# EAGLE design breakout0 (EAGLE 5.11)
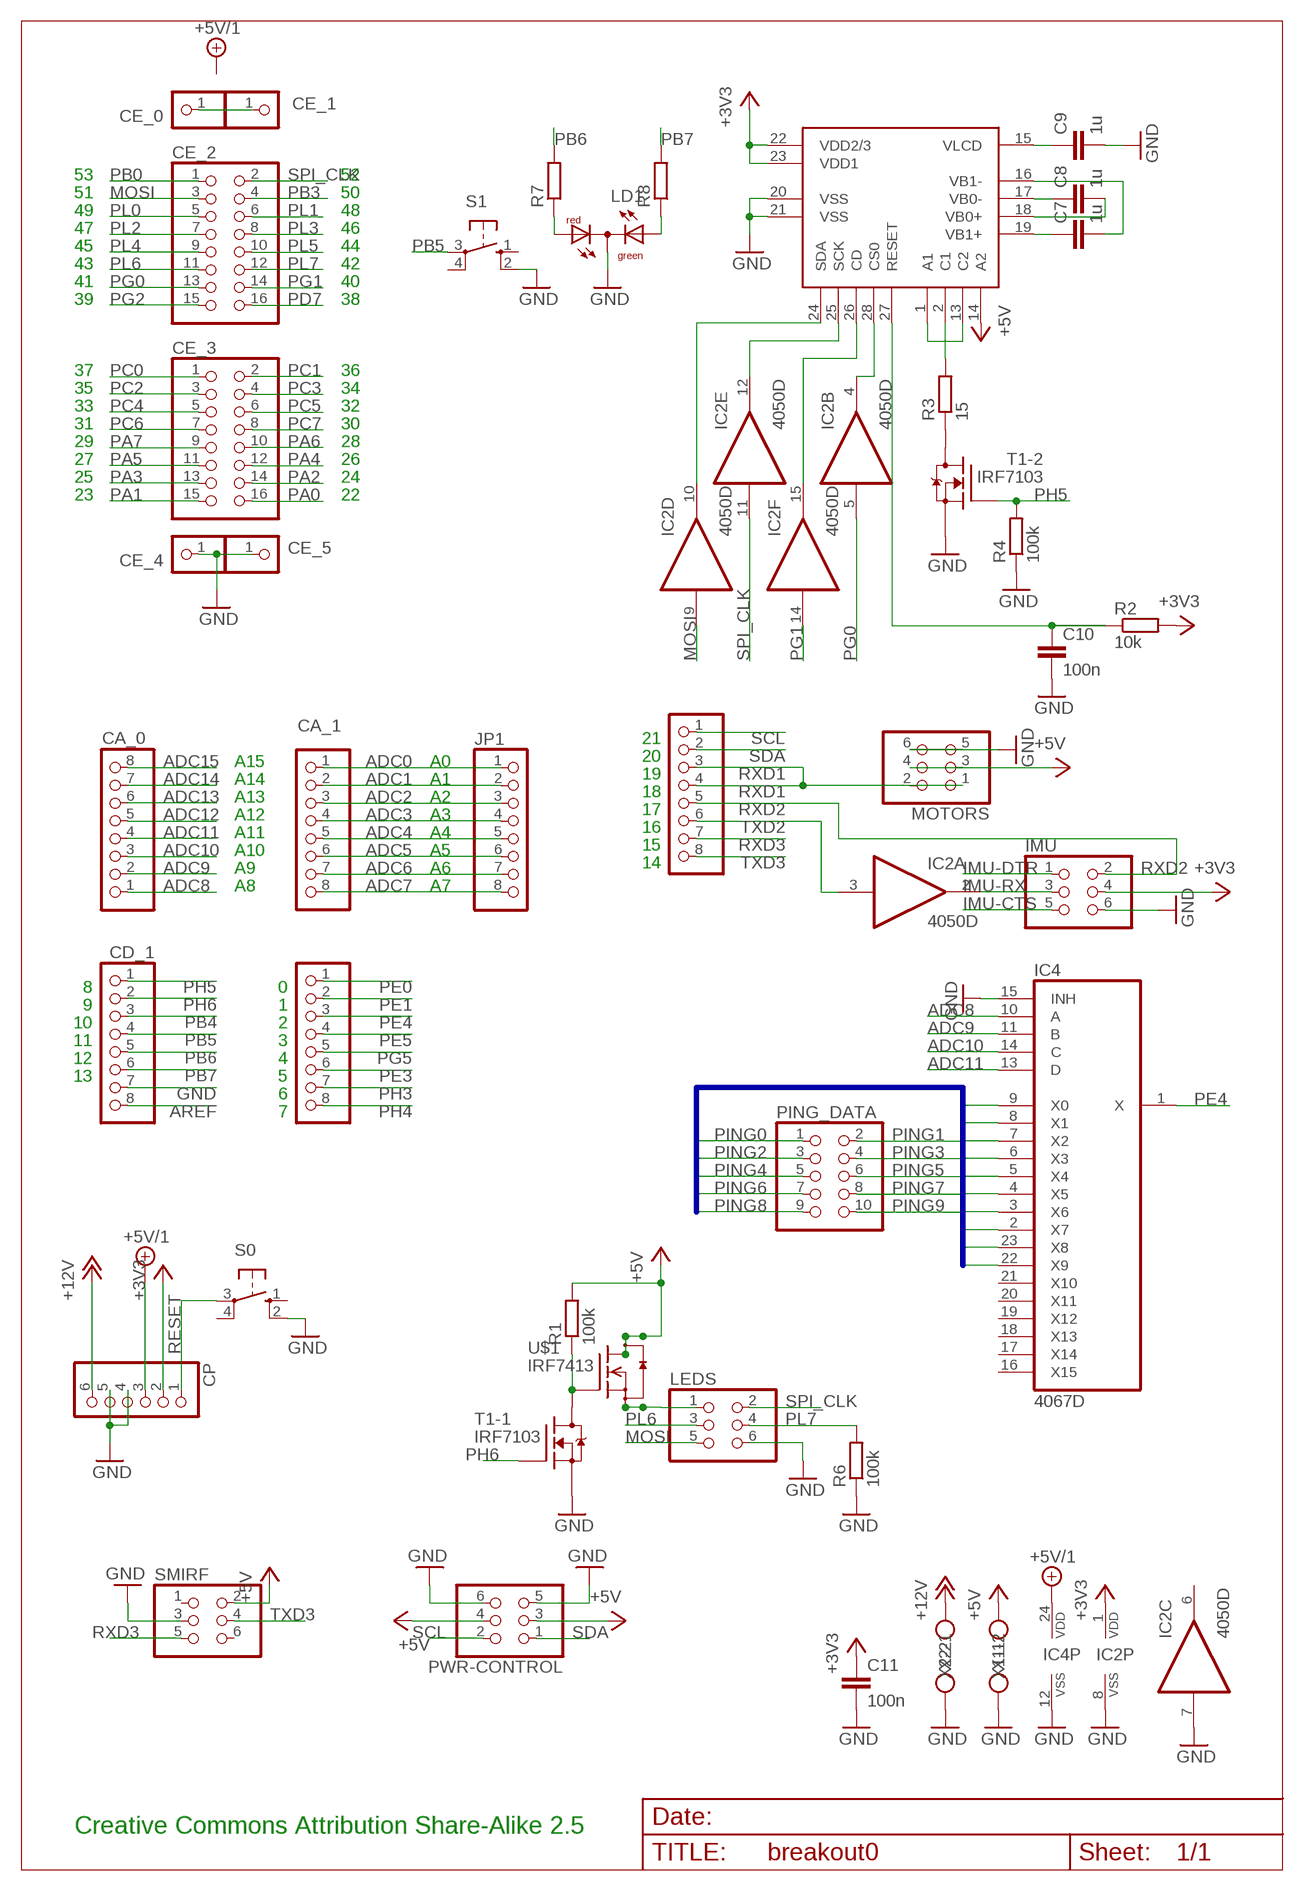
[diagram p0: schematic, sheet 1]

## Parts
C7  1u  C-EUC0805K  [C0805K]
C8  1u  C-EUC0805K  [C0805K]
C9  1u  C-EUC0805K  [C0805K]
C10  100n  C-EUC0805K  [C0805K]
C11  100n  C-EUC0805K  [C0805K]
CA_0  PINHD-1X8  [1X08]
CA_1  PINHD-1X8  [1X08]
CC  PINHD-1X8  [1X08]
CD_0  PINHD-1X8  [1X08]
CD_1  PINHD-1X8  [1X08]
CE_0  PINHD-1X1  [1X01]
CE_1  PINHD-1X1  [1X01]
CE_2  PINHD-2X8  [2X08]
CE_3  PINHD-2X8  [2X08]
CE_4  PINHD-1X1  [1X01]
CE_5  PINHD-1X1  [1X01]
CP  PINHD-1X6  [1X06]
IC2  4050D  [SO16]
IC3  DOGS 102  DOGS102  [DOGS102]
IC4  4067D  [SO24W]
IMU  PINHD-2X3  [2X03]
JP1  PINHD-1X8  [1X08]
LD1  DUOLED-RG-C  [DUOLED-C-5MM]
LEDS  PINHD-2X3  [2X03]
MOTORS  PINHD-2X3  [2X03]
PING_DATA  PINHD-2X5  [2X05]
PWR-CONTROL  PINHD-2X3  [2X03]
R1  100k  R-EU_M0805  [M0805]
R2  10k  R-EU_M0805  [M0805]
R3  15  R-EU_M0805  [M0805]
R4  100k  R-EU_M0805  [M0805]
R6  100k  R-EU_M0805  [M0805]
R7  R-EU_M0805  [M0805]
R8  R-EU_M0805  [M0805]
S0  10-XX  [B3F-10XX]
S1  10-XX  [B3F-10XX]
SMIRF  PINHD-2X3  [2X03]
T1  IRF7103  [SO-8]
U$1  IRF7413  [SO08-IRF]
X1  MKDSN1,5/2-5,08  [MKDSN1,5/2-5,08]
X2  MKDSN1,5/2-5,08  [MKDSN1,5/2-5,08]

## Nets
+3V3: C11.1 CP.2 IC2.1(P:VDD) IC3.22(VDD2/3) IC3.23(VDD1) IMU.4 R2.2
+5V [power]: IC3.14(A2) MOTORS.3 MOTORS.4 PWR-CONTROL.3 PWR-CONTROL.4 R1.2 SMIRF.2 U$1.5(D1) U$1.6(D2) U$1.7(D3) U$1.8(D4) X1.1
+5V/1 [power]: CP.3 IC4.24(VDD)
+12V: CP.6 X2.2
ADC0: CA_1.1 JP1.1
ADC1: CA_1.2 JP1.2
ADC2: CA_1.3 JP1.3
ADC3: CA_1.4 JP1.4
ADC4: CA_1.5 JP1.5
ADC5: CA_1.6 JP1.6
ADC6: CA_1.7 JP1.7
ADC7: CA_1.8 JP1.8
ADC8: CA_0.1 IC4.10(A)
ADC9: CA_0.2 IC4.11(B)
ADC10: CA_0.3 IC4.14(C)
ADC11: CA_0.4 IC4.13(D)
ADC12: CA_0.5
ADC13: CA_0.6
ADC14: CA_0.7
ADC15: CA_0.8
AREF: CD_1.8
GND [gnd]: C9.2 C10.2 C11.2 CD_1.7 CE_4.1 CE_5.1 CP.4 CP.5 IC2.7(C:I) IC2.8(P:VSS) IC3.20(VSS) IC3.21(VSS) IC4.12(VSS) IC4.15(INH) IMU.6 LD1.C LEDS.6 MOTORS.5 MOTORS.6 PWR-CONTROL.5 PWR-CONTROL.6 R4.1 R6.1 S0.2(S1) S1.2(S1) SMIRF.3 T1.1(-1:S) T1.3(-2:S) X1.2 X2.1
IMU-CTS: IMU.5
IMU-DTR: IMU.1
IMU-RX: IC2.2(A:O) IMU.3
LCD_CD: IC2.15(F:O) IC3.26(CD)
LCD_CS0: IC2.4(B:O) IC3.28(CS0)
LCD_RESET: C10.1 IC3.27(RESET) R2.1
LCD_SCK: IC2.12(E:O) IC3.25(SCK)
LCD_SDA: IC2.10(D:O) IC3.24(SDA)
MOSI: CE_2.3 IC2.9(D:I) LEDS.5
N$1: R3.1 T1.5(-2:D1)
N$2 [power]: LEDS.1 U$1.1(S1) U$1.2(S2) U$1.3(S3)
N$3: R1.1 T1.7(-1:D1) U$1.4(G)
N$4: LD1.AR R7.1
N$5: LD1.AX(AG) R8.1
N$7 [power]: CE_0.1 CE_1.1
N$13: IC3.1(A1) IC3.13(C2)
N$14: IC3.2(C1) R3.2
N$17: C8.1 IC3.17(VB0-)
N$18: C8.2 IC3.18(VB0+)
N$19: C7.1 IC3.19(VB1+)
N$20: C7.2 IC3.16(VB1-)
N$21: C9.1 IC3.15(VLCD)
PA0: CE_3.16
PA1: CE_3.15
PA2: CE_3.14
PA3: CE_3.13
PA4: CE_3.12
PA5: CE_3.11
PA6: CE_3.10
PA7: CE_3.9
PB0: CE_2.1
PB3: CE_2.4
PB4: CD_1.3
PB5: CD_1.4 S1.3(P)
PB6: CD_1.5 R7.2
PB7: CD_1.6 R8.2
PC0: CE_3.1
PC1: CE_3.2
PC2: CE_3.3
PC3: CE_3.4
PC4: CE_3.5
PC5: CE_3.6
PC6: CE_3.7
PC7: CE_3.8
PD7: CE_2.16
PE0: CD_0.1
PE1: CD_0.2
PE3: CD_0.6
PE4: CD_0.3 IC4.1(X)
PE5: CD_0.4
PG0: CE_2.13 IC2.5(B:I)
PG1: CE_2.14 IC2.14(F:I)
PG2: CE_2.15
PG5: CD_0.5
PH3: CD_0.7
PH4: CD_0.8
PH5: CD_1.1 R4.2 T1.4(-2:G)
PH6: CD_1.2 T1.2(-1:G)
PING0: IC4.9(X0) PING_DATA.1
PING1: IC4.8(X1) PING_DATA.2
PING2: IC4.7(X2) PING_DATA.3
PING3: IC4.6(X3) PING_DATA.4
PING4: IC4.5(X4) PING_DATA.5
PING5: IC4.4(X5) PING_DATA.6
PING6: IC4.3(X6) PING_DATA.7
PING7: IC4.2(X7) PING_DATA.8
PING8: IC4.23(X8) PING_DATA.9
PING9: IC4.22(X9) PING_DATA.10
PL0: CE_2.5
PL1: CE_2.6
PL2: CE_2.7
PL3: CE_2.8
PL4: CE_2.9
PL5: CE_2.10
PL6: CE_2.11 LEDS.3
PL7: CE_2.12 LEDS.4 R6.2
RESET: CP.1 S0.3(P)
RXD1: CC.3 CC.4 MOTORS.1 MOTORS.2
RXD2: CC.5 IMU.2
RXD3: CC.7 SMIRF.5
SCL: CC.1 PWR-CONTROL.2
SDA: CC.2 PWR-CONTROL.1
SPI_CLK: CE_2.2 IC2.11(E:I) LEDS.2
TXD2: CC.6 IC2.3(A:I)
TXD3: CC.8 SMIRF.4
Unconnected: IC2.6(C:O) IC4.16(X15) IC4.17(X14) IC4.18(X13) IC4.19(X12) IC4.20(X11) IC4.21(X10) S0.1(S) S0.4(P1) S1.1(S) S1.4(P1) SMIRF.1 SMIRF.6 T1.6(-2:D) T1.8(-1:D)

## Buses
PING[0..9]

## Notes on the sheet
- 53 | 52
- 51 | 50
- 49 | 48
- 47 | 46
- 45 | 44
- 43 | 42
- 41 | 40
- 39 | 38
- 37 | 36
- 35 | 34
- 33 | 32
- 31 | 30
- 29 | 28
- 27 | 26
- 25 | 24
- 23 | 22
- 21
- 20
- A15 | A0 | 19
- A14 | A1 | 18
- A13 | A2 | 17
- A12 | A3 | 16
- A11 | A4 | 15
- A10 | A5 | 14
- A9 | A6
- A8 | A7
- 8 | 0
- 9 | 1
- 10 | 2
- 11 | 3
- 12 | 4
- 13 | 5
- 6
- 7
- Creative Commons Attribution Share-Alike 2.5

## Library data of the parts
C7-C11 = rcl:C-EU: CAPACITOR, European symbol
CA_0 CA_1 CC CD_0 CD_1 JP1 = pinhead:PINHD-1X8: PIN HEADER
CE_0 CE_1 CE_4 CE_5 = pinhead:PINHD-1X1: PIN HEADER
CE_2 CE_3 = pinhead:PINHD-2X8: PIN HEADER
CP = pinhead:PINHD-1X6: PIN HEADER
IC2 = 40xx:4050: Hex non-inverting BUFFER
IC3 = DOGS102:DOGS102: DOGS102-6 GRAFIK 102x64 39x41 mm LED-BELEUCHTUNG WEISS, EA LED39X41-W LED-BELEUCHTUNG AMBER, EA LED39X41-A LED-BELEUCHTUNG GR/ROT , EA LED39X41-GR
IC4 = 40xx:4067: 16-channel ANALOG MULTIPLEXER
IMU LEDS MOTORS PWR-CONTROL SMIRF = pinhead:PINHD-2X3: PIN HEADER
LD1 = led:DUOLED-RG-C: DUO LED 2 colors (red/green), 5 mm, round, common Cathode www.ligitek.com or other producers.
PING_DATA = pinhead:PINHD-2X5: PIN HEADER
R1-R3 R7 R8 = rcl:R-EU_: RESISTOR, European symbol
R4 R6 = resistor:R-EU_: RESISTOR, European symbol
S0 S1 = switch-omron:10-XX: OMRON SWITCH
T1 = transistor-fet:IRF7103: Dual N-Channel MOSFET
U$1 = transistor-fet:IRF7413: HEXFET Power MOSFET
X1 X2 = con-phoenix-508:MKDSN1,5/2-5,08: MKDSN 1,5/ 2-5,08 Printklemme Nennstrom: 13,5 A Nennspannung: 250 V Rastermaß: 5,08 mm Polzahl: 2 Anschlussart: Schraubanschluss Montage: Löten Anschlussrichtung Leiter/Platine: 0 ° Artikelnummer: 1729128 Source: http://eshop.phoenixcontact.com .. 1729128.pdf

## Net classes
0 default: width 0.203 mm, drill 0.406 mm, clearance 0.203 mm
1 power: width 0.61 mm, drill 0.711 mm, clearance 0.203 mm
2 gnd: width 0.305 mm, drill 0.711 mm, clearance 0.203 mm
3 usbvcc: width 0.508 mm, drill 0.711 mm, clearance 0.203 mm

## Board
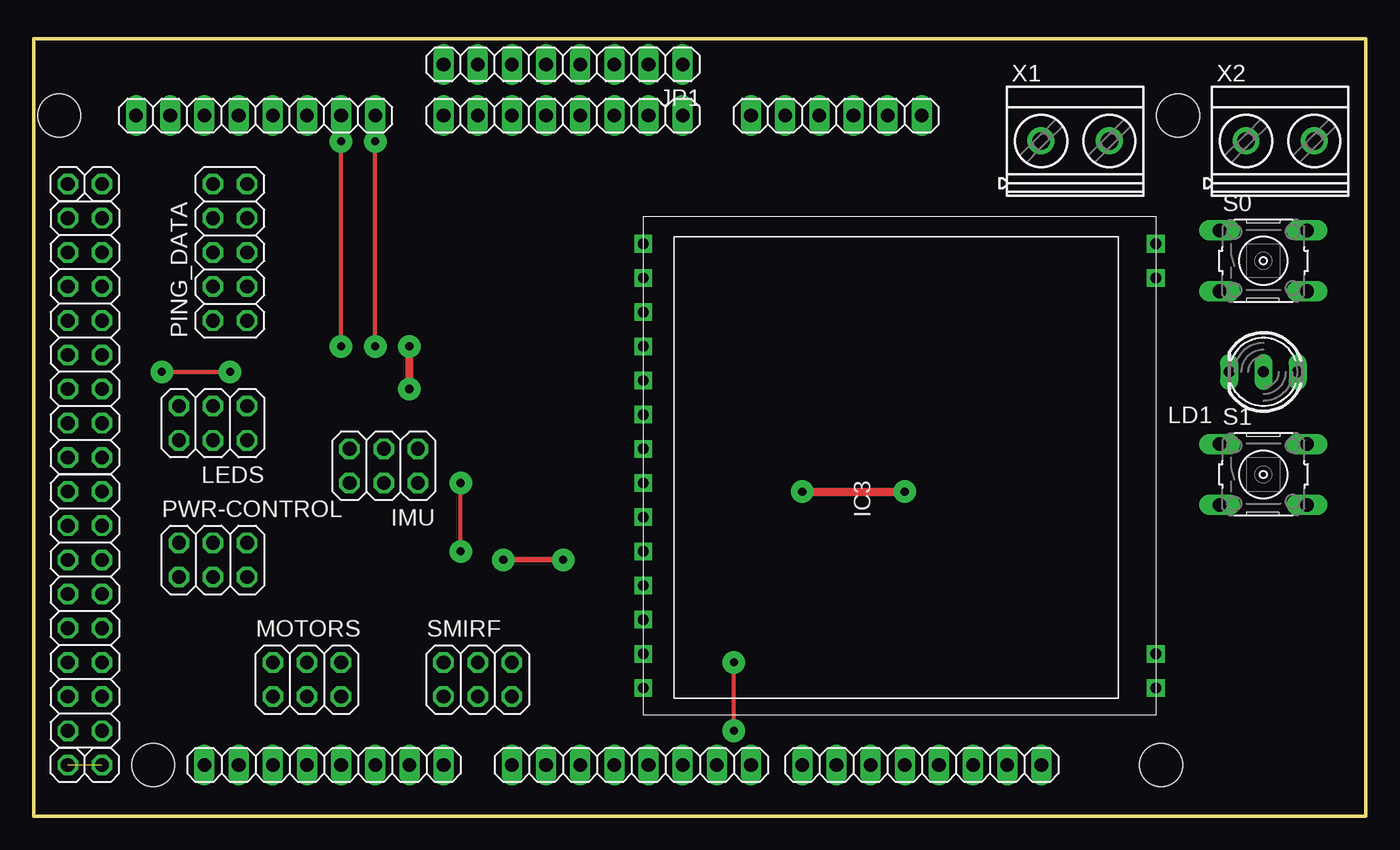
[diagram p1: board, top side]
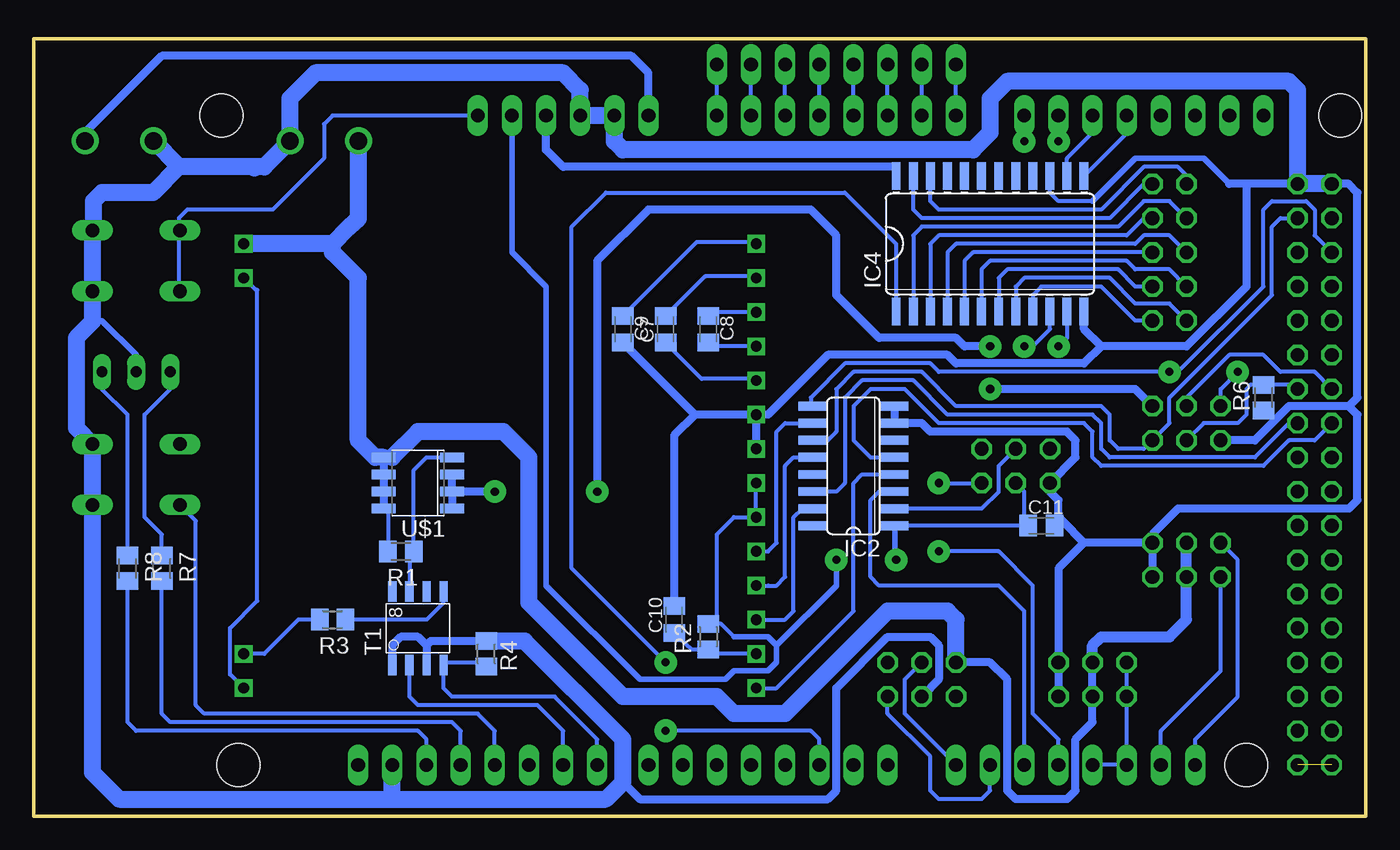
[diagram p2: board, bottom side, seen from below]

Size 99.06 x 57.78 mm. Coordinates in mm from the lower left corner, seen from the top.
Outline: 99.06,0 0,0 0,57.78 99.06,57.78 99.06,0
Copper layers (1*16): Top 0.035mm / dielectric 1.5mm / Bottom 0.035mm
Design rules "default *": minimum track width 8mil, minimum drill 16mil, track to track 8mil, track to pad 8mil, pad to pad 8mil, via to via 10mil, smd to smd 8mil, copper to edge 40mil, drill to drill 12mil, minimum pad ring 10mil, minimum via ring 10mil, stop-mask expansion 4mil, vias tented up to drill 0mil, thermal gap 10mil
Holes 3.2 mm at 85.09,52.07 83.82,3.81 8.89,3.81 1.91,52.07
bKeepout: area 85.7,1.9 to 99.1,21.6

### Footprints (pad centres in the part's own frame; a part is rotated, then mirrored left to right if it is on the bottom)
C0805K = smd 1.3 x 1.6: 1 -1,0; 2 1,0
1X08 = drill 1.016 long: 1 -8.89,0; 2 -6.35,0; 3 -3.81,0; 4 -1.27,0; 5 1.27,0; 6 3.81,0; 7 6.35,0; 8 8.89,0
1X01 = drill 1.016 octagon: 1 0,0
2X08 = drill 1.016 octagon: 1 -8.89,-1.27; 2 -8.89,1.27; 3 -6.35,-1.27; 4 -6.35,1.27; 5 -3.81,-1.27; 6 -3.81,1.27; 7 -1.27,-1.27; 8 -1.27,1.27; 9 1.27,-1.27; 10 1.27,1.27; 11 3.81,-1.27; 12 3.81,1.27; 13 6.35,-1.27; 14 6.35,1.27; 15 8.89,-1.27; 16 8.89,1.27
1X06 = drill 1.016 long: 1 -6.35,0; 2 -3.81,0; 3 -1.27,0; 4 1.27,0; 5 3.81,0; 6 6.35,0
SO16 = smd 0.66 x 2.032: 1 -4.445,-3.073; 2 -3.175,-3.073; 3 -1.905,-3.073; 4 -0.635,-3.073; 5 0.635,-3.073; 6 1.905,-3.073; 7 3.175,-3.073; 8 4.445,-3.073; 9 4.445,3.073; 10 3.175,3.073; 11 1.905,3.073; 12 0.635,3.073; 13 -0.635,3.073; 14 -1.905,3.073; 15 -3.175,3.073; 16 -4.445,3.073
DOGS102 = drill 0.8 square: 1 -17.018,-19.304; 2 -14.478,-19.304; 13 13.462,-19.304; 14 16.002,-19.304; 15 16.002,18.796; 16 13.462,18.796; 17 10.922,18.796; 18 8.382,18.796; 19 5.842,18.796; 20 3.302,18.796; 21 0.762,18.796; 22 -1.778,18.796; 23 -4.318,18.796; 24 -6.858,18.796; 25 -9.398,18.796; 26 -11.938,18.796; 27 -14.478,18.796; 28 -17.018,18.796
SO24W = smd 0.66 x 2.032: 1 -6.985,-5.029; 2 -5.715,-5.029; 3 -4.445,-5.029; 4 -3.175,-5.029; 5 -1.905,-5.029; 6 -0.635,-5.029; 7 0.635,-5.029; 8 1.905,-5.029; 9 3.175,-5.029; 10 4.445,-5.029; 11 5.715,-5.029; 12 6.985,-5.029; 13 6.985,5.029; 14 5.715,5.029; 15 4.445,5.029; 16 3.175,5.029; 17 1.905,5.029; 18 0.635,5.029; 19 -0.635,5.029; 20 -1.905,5.029; 21 -3.175,5.029; 22 -4.445,5.029; 23 -5.715,5.029; 24 -6.985,5.029
2X03 = drill 1.016 octagon: 1 -2.54,-1.27; 2 -2.54,1.27; 3 0,-1.27; 4 0,1.27; 5 2.54,-1.27; 6 2.54,1.27
DUOLED-C-5MM = drill 0.813 long: AR 2.54,0; AX -2.54,0; C 0,0
2X05 = drill 1.016 octagon: 1 -5.08,-1.27; 2 -5.08,1.27; 3 -2.54,-1.27; 4 -2.54,1.27; 5 0,-1.27; 6 0,1.27; 7 2.54,-1.27; 8 2.54,1.27; 9 5.08,-1.27; 10 5.08,1.27
M0805 = smd 1.3 x 1.6: 1 -0.95,0; 2 0.95,0
B3F-10XX = drill 1.016 long: 1 -3.251,2.261; 2 3.251,2.261; 3 -3.251,-2.261; 4 3.251,-2.261
SO-8 = smd 1.524 x 0.61: 1 -2.743,1.905; 2 -2.743,0.635; 3 -2.743,-0.635; 4 -2.743,-1.905; 5 2.743,-1.905; 6 2.743,-0.635; 7 2.743,0.635; 8 2.743,1.905
SO08-IRF = smd 0.72 x 1.78: 1 -1.905,-2.543; 2 -0.635,-2.543; 3 0.635,-2.543; 4 1.905,-2.543; 5 1.905,2.543; 6 0.635,2.543; 7 -0.635,2.543; 8 -1.905,2.543
MKDSN1,5/2-5,08 = drill 1.3 pad 2 round: 1 -2.561,0.025; 2 2.519,0.025

### Placement (x,y rotation side)
C7  52.07,36.2 90 bottom
C8  48.9,36.2 270 bottom
C9  55.24,36.2 270 bottom
C10  51.44,14.61 90 bottom
C11  24.13,21.59 0 bottom
CA_0  16.51,52.07 180 top
CA_1  39.37,52.07 180 top
CC  21.59,3.81 0 top
CD_0  44.45,3.81 0 top
CD_1  66.04,3.81 0 top
CE_0  2.54,3.81 180 top
CE_1  5.08,3.81 180 top
CE_2  3.81,35.56 270 top
CE_3  3.81,15.24 270 top
CE_4  2.54,46.99 180 top
CE_5  5.08,46.99 180 top
CP  59.69,52.07 180 top
IC2  38.1,26.04 90 bottom
IC3  64.14,26.54 90 top
IC4  27.94,42.55 0 bottom
IMU  26.04,26.04 180 top
JP1  39.37,55.88 180 top
LD1  91.44,33.02 180 top
LEDS  13.34,29.21 180 top
MOTORS  20.32,10.16 0 top
PING_DATA  14.61,41.91 90 top
PWR-CONTROL  13.34,19.05 0 top
R1  71.75,19.68 180 bottom
R2  48.9,13.34 90 bottom
R3  76.83,14.61 180 bottom
R4  65.41,12.06 270 bottom
R6  7.62,31.11 90 bottom
R7  89.53,18.41 270 bottom
R8  92.08,18.41 270 bottom
S0  91.44,41.27 0 top
S1  91.44,25.4 0 top
SMIRF  33.02,10.16 0 top
T1  70.48,13.97 90 bottom
U$1  70.48,24.77 90 bottom
X1  77.47,50.16 0 top
X2  92.71,50.16 0 top

### Tracks (layer width: path | path; a pad name or v marks a point on that pad's centre or on a via)
+3V3  (via drill 0.6 pad 1.68)
  Top 0.406: v34.92,19.05 v39.37,19.05
  Bottom 0.305: IC3.22 IC3.23 46.99,22.23 48.26,20.95 48.26,14.29 | 25.4,21.59 IC2.1 34.92,21.49 | 25.4,21.59 25.4,24.13 IMU.4 | C11.1 25.4,21.59 | 48.26,14.29 R2.2 | 46.99,13.34 47.94,14.29 48.26,14.29
  Bottom 0.406: CP.2 63.5,41.91 60.96,39.37 60.96,17.14 53.98,10.16 47.62,10.16 46.99,10.79 44.45,10.79 43.81,11.43 43.81,12.7 | 43.81,12.7 44.45,13.34 46.99,13.34 | IC2.1 35.03,19.15 v34.92,19.05 | v39.37,19.05 39.37,17.14 43.81,12.7
+5V
  Bottom 0.305: R1.2 72.7,22.54 U$1.8
  Bottom 0.61: MOTORS.4 MOTORS.3 20.32,6.99 21.59,5.71 21.59,1.91 22.23,1.27 26.04,1.27 26.67,1.91 26.67,10.16 27.94,11.43 SMIRF.2 | U$1.8 U$1.7 U$1.6 U$1.5 72.39,26.67
  Bottom 0.813: MOTORS.4 20.32,12.7 19.68,13.34 14.61,13.34 13.34,14.61 PWR-CONTROL.3 PWR-CONTROL.4
  Bottom 1.27: 76.83,42.55 IC3.14 | X1.1 74.91,44.43 75.59,43.79 76.83,42.55 | 76.83,42.55 76.83,41.91 74.93,40.01 74.93,27.94 73.66,26.67 U$1.5 | 72.39,26.67 70.48,28.57 64.14,28.57 62.23,26.67 62.23,15.88 55.24,8.89 48.26,8.89 46.99,7.62 43.18,7.62 35.56,15.24 31.11,15.24 30.48,14.61 SMIRF.2
+5V/1
  Bottom 0.406: IC4.24 34.92,48.26
  Bottom 0.61: 34.92,48.26 59.69,48.26 60.96,49.53 CP.3
+12V
  Bottom 0.61: CP.6 53.34,55.24 54.61,56.52 89.53,56.52 95.25,50.8 95.25,50.21
  Bottom 1.27: 95.25,50.21 X2.2
ADC0
  Bottom 0.305: CA_1.1 JP1.1
ADC1
  Bottom 0.305: CA_1.2 JP1.2
ADC2
  Bottom 0.305: CA_1.3 JP1.3
ADC3
  Bottom 0.305: CA_1.4 JP1.4
ADC4
  Bottom 0.305: CA_1.5 JP1.5
ADC5
  Bottom 0.305: CA_1.6 JP1.6
ADC6
  Bottom 0.305: CA_1.7 JP1.7
ADC7
  Bottom 0.305: CA_1.8 JP1.8
ADC8  (via drill 0.6 pad 1.68)
  Top 0.305: v25.4,34.92 v25.4,50.16
  Bottom 0.305: v25.4,50.16 CA_0.1 | v25.4,34.92 24.77,34.92 23.5,36.2 IC4.10
ADC9  (via drill 0.6 pad 1.68)
  Top 0.305: v22.86,34.92 v22.86,50.16
  Bottom 0.305: v22.86,50.16 CA_0.2 | v22.86,34.92 22.23,35.56 IC4.11
ADC10
  Bottom 0.305: CA_0.3 20.32,50.8 22.23,48.9 IC4.14
ADC11
  Bottom 0.305: CA_0.4 17.78,50.75 IC4.13
GND
  Bottom 0.305: 20.32,45.72 22.86,45.72 23.5,46.35 IC4.15 | R6.1 6.67,29.53
  Bottom 0.406: 20.32,45.72 17.14,48.9 12.06,48.9 10.16,46.99 | LD1.C 91.44,34.29 93.98,36.83 94.61,36.83 94.69,36.75
  Bottom 0.61: 69.85,12.7 T1.3 | 1.27,30.48 0.64,31.11 0.64,46.35 1.27,46.99 CE_4.1 | 69.85,12.7 69.53,13.02 R4.1 | 49.9,29.84 C9.2 | IC3.20 49.9,29.84 | IC3.20 IC3.21 | C10.2 51.44,28.3 49.9,29.84 | CE_5.1 8.89,46.99 | 8.89,46.99 10.16,46.99 | 1.27,30.48 5.71,30.48 6.67,29.53 8.26,27.94 LEDS.6 | 19.68,34.92 20.95,36.2 IC4.12 | PWR-CONTROL.6 PWR-CONTROL.5 | MOTORS.5 MOTORS.6 22.86,18.41 20.95,20.32 | 20.95,20.32 22.54,21.91 | 22.54,21.91 22.86,22.23 22.86,23.5 23.5,24.13 IMU.6 21.59,26.67 21.59,27.94 22.23,28.57 32.38,28.57 33.02,29.21 IC2.7 IC2.8 | PWR-CONTROL.6 20.95,20.32 | T1.1 72.39,12.7 71.75,13.34 70.48,13.34 69.85,12.7 | 19.68,34.92 13.34,34.92 8.89,39.37 8.89,46.99 | IC3.20 44.45,29.84 40.01,34.29 31.11,34.29 30.48,33.66 20.95,33.66 19.68,34.92 | PWR-CONTROL.6 15.88,20.95 13.97,22.86 1.27,22.86 0.64,23.5 0.64,29.84 1.27,30.48 | SMIRF.3 31.75,10.16 31.75,12.7 32.38,13.34 35.56,13.34 39.37,9.53 39.37,1.91 40.01,1.27 53.98,1.27 55.24,2.54 | C11.2 22.86,21.59 22.54,21.91
  Bottom 1.27: 72.39,1.27 56.52,1.27 55.24,2.54 55.24,5.71 62.55,13.02 R4.1 | 72.39,1.27 CD_1.7 | CE_4.1 CE_5.1 5.08,53.98 5.71,54.61 26.67,54.61 27.94,53.34 27.94,50.8 29.21,49.53 55.24,49.53 55.88,50.16 CP.5 CP.4 58.42,53.98 59.69,55.24 78.11,55.24 80.01,53.34 80.01,50.21 X1.2 81.92,48.26 82.55,48.26 | 72.39,1.27 92.71,1.27 94.69,3.25 S1.2 95.89,28.85 95.89,35.56 94.69,36.75 S0.2 94.61,43.61 94.61,45.72 93.98,46.35 90.17,46.35 88.27,48.26 88.22,48.26 | 82.55,48.26 88.22,48.26 | 88.22,48.26 X2.1 | 82.55,48.26 82.63,48.18
IMU-RX
  Bottom 0.305: IC2.2 28.57,22.86 27.3,24.13 27.3,26.04 IMU.3
LCD_CD
  Bottom 0.305: IC2.15 41.91,22.86 42.55,22.23 42.55,15.24 43.18,14.61 IC3.26
LCD_CS0
  Bottom 0.305: IC2.4 37.47,25.4 38.1,24.77 38.1,15.24 43.81,9.53 IC3.28
LCD_RESET
  Bottom 0.305: IC3.27 48.26,12.06 R2.1 50.12,12.38 C10.1
LCD_SCK
  Bottom 0.305: IC2.12 42.55,26.67 43.18,26.04 43.18,17.78 43.81,17.14 44.45,17.14 IC3.25
LCD_SDA
  Bottom 0.305: IC2.10 43.18,29.21 43.81,28.57 43.81,20.32 44.45,19.68 IC3.24
MOSI  (via drill 0.6 pad 1.68)
  Top 0.305: v9.53,33.02 v14.61,33.02
  Bottom 0.305: CE_2.3 3.81,43.18 3.81,45.09 4.45,45.72 6.99,45.72 7.62,45.09 7.62,39.37 13.97,33.02 v14.61,33.02 31.75,33.02 32.38,33.66 38.73,33.66 41.27,31.11 41.27,30.58 IC2.9 41.17,30.58 | v9.53,33.02 10.79,31.75 LEDS.5
N$1
  Bottom 0.305: T1.5 68.58,15.88 69.85,14.61 R3.1
N$2  (via drill 0.6 pad 1.68)
  Top 0.61: v27.94,31.75 v27.94,34.92 | v57.15,24.13 v64.77,24.13
  Bottom 0.61: U$1.2 U$1.1 | U$1.2 U$1.3 | LEDS.1 17.14,31.75 v27.94,31.75 | v27.94,34.92 29.84,34.92 30.48,35.56 36.2,35.56 39.37,38.73 39.37,43.18 41.27,45.09 53.34,45.09 57.15,41.27 v57.15,24.13 | v64.77,24.13 U$1.2
N$3
  Bottom 0.305: T1.7 71.12,19.37 R1.1 70.81,25.71 69.85,26.67 U$1.4
N$4
  Bottom 0.305: R7.1 89.53,20.95 90.81,22.23 90.81,29.84 88.9,31.75 LD1.AR
N$5
  Bottom 0.305: R8.1 92.08,29.84 93.98,31.75 LD1.AX
N$7  (1 unrouted)
N$13
  Bottom 0.305: IC3.1 84.45,10.54 84.45,13.97 82.42,16 82.42,39.12 82.55,39.12 IC3.13
N$14
  Bottom 0.305: R3.2 79.38,14.61 81.92,12.06 IC3.2
N$17
  Bottom 0.305: IC3.17 48.62,37.47 C8.1
N$18
  Bottom 0.305: IC3.18 48.62,34.92 C8.2
N$19
  Bottom 0.305: C7.1 49.39,32.51 45.47,32.51 IC3.19
N$20
  Bottom 0.305: C7.2 49.13,40.13 45.47,40.13 IC3.16
N$21
  Bottom 0.305: 55.24,37.47 C9.1 49.77,42.67 45.47,42.67 IC3.15
PB5
  Bottom 0.305: CD_1.4 64.77,6.35 66.04,7.62 86.36,7.62 87,8.26 87,21.95 S1.3
PB6
  Bottom 0.305: CD_1.5 67.31,6.35 67.94,6.99 88.9,6.99 89.53,7.62 R7.2
PB7
  Bottom 0.305: CD_1.6 69.85,5.71 70.48,6.35 91.44,6.35 92.08,6.99 R8.2
PE4  (via drill 0.6 pad 1.68)
  Top 0.305: v52.07,6.35 v52.07,11.43
  Bottom 0.305: CD_0.3 40.64,5.71 41.27,6.35 v52.07,6.35 | IC4.1 34.92,42.55 38.73,46.35 56.52,46.35 59.05,43.81 59.05,18.41 v52.07,11.43
PG0
  Bottom 0.305: IC2.5 36.83,26.67 38.1,27.94 38.1,30.48 36.83,31.75 34.29,31.75 31.75,29.21 20.95,29.21 20.32,28.57 20.32,26.67 19.68,26.04 7.62,26.04 5.71,27.94 3.81,27.94 CE_2.13
PG1
  Bottom 0.305: IC2.14 39.37,24.13 38.73,24.77 38.73,31.11 37.47,32.38 33.66,32.38 31.11,29.84 20.32,29.84 19.68,29.21 19.68,27.3 19.05,26.67 8.26,26.67 5.71,29.21 CE_2.14
PH5
  Bottom 0.305: 68.58,10.79 T1.4 68.38,11.43 | 68.38,11.43 68.58,11.43 68.58,9.53 67.94,8.89 60.33,8.89 57.15,5.71 CD_1.1 | 68.38,11.43 65.72,11.43 R4.2
PH6
  Bottom 0.305: T1.2 71.12,8.89 70.48,8.26 61.59,8.26 59.69,6.35 CD_1.2
PING0
  Bottom 0.305: IC4.9 24.77,38.73 24.13,39.37 19.68,39.37 17.14,36.83 PING_DATA.1
PING1
  Bottom 0.305: IC4.8 26.04,39.37 25.4,40.01 19.05,40.01 17.14,38.1 14.61,38.1 PING_DATA.2
PING2
  Bottom 0.305: IC4.7 27.3,40.01 26.67,40.64 18.41,40.64 17.14,39.37 PING_DATA.3
PING3
  Bottom 0.305: IC4.6 28.57,40.64 27.94,41.27 17.78,41.27 17.14,40.64 14.61,40.64 PING_DATA.4
PING4
  Bottom 0.305: IC4.5 29.84,41.27 29.21,41.91 PING_DATA.5
PING5
  Bottom 0.305: IC4.4 31.11,41.91 30.48,42.55 17.14,42.55 16.51,43.18 14.61,43.18 PING_DATA.6
PING6
  Bottom 0.305: IC4.3 32.38,42.55 31.75,43.18 17.78,43.18 16.51,44.45 PING_DATA.7
PING7
  Bottom 0.305: IC4.2 33.66,43.18 33.02,43.81 18.41,43.81 16.51,45.72 14.61,45.72 PING_DATA.8
PING8
  Bottom 0.305: IC4.23 33.66,45.09 33.02,44.45 19.05,44.45 16.51,46.99 PING_DATA.9
PING9
  Bottom 0.305: IC4.22 32.38,45.72 31.75,45.09 19.68,45.09 16.51,48.26 13.97,48.26 13.34,47.62 PING_DATA.10
PL6
  Bottom 0.305: CE_2.11 3.81,33.02 6.35,33.02 7.62,34.29 10.16,34.29 13.34,31.11 LEDS.3
PL7
  Bottom 0.305: CE_2.12 5.4,32.06 R6.2 8.57,32.06 8.89,31.75 8.89,29.84 9.53,29.21 12.06,29.21 LEDS.4
RESET
  Bottom 0.305: CP.1 76.83,52.07 77.47,51.44 77.47,48.9 80.01,46.35 81.28,45.09 87.63,45.09 88.27,44.45 88.27,39.09 S0.3
RXD1
  Bottom 0.305: CC.4 CC.3 MOTORS.1 MOTORS.2
RXD2  (via drill 0.6 pad 1.68)
  Top 0.305: v31.75,19.68 v31.75,24.77
  Bottom 0.305: v31.75,24.77 IMU.2 | v31.75,19.68 27.3,19.68 24.77,17.14 24.77,7.62 22.86,5.71 CC.5
RXD3
  Bottom 0.305: SMIRF.5 35.56,7.62 32.38,4.45 32.38,1.91 31.75,1.27 28.57,1.27 27.94,1.91 CC.7
SCL
  Bottom 0.305: CC.1 12.7,5.71 9.53,8.89 9.53,19.05 PWR-CONTROL.2
SDA
  Bottom 0.305: CC.2 15.24,6.35 10.79,10.79 PWR-CONTROL.1
SPI_CLK
  Bottom 0.305: CE_2.2 6.35,44.45 6.99,43.81 6.99,38.73 14.61,31.11 14.61,29.21 LEDS.2 16.51,27.3 18.41,27.3 19.05,27.94 19.05,29.84 19.68,30.48 30.48,30.48 33.02,33.02 38.1,33.02 39.37,31.75 39.37,28.57 40.01,27.94 IC2.11
TXD2
  Bottom 0.305: IC2.3 36.2,24.13 36.83,23.5 36.83,17.78 36.2,17.14 27.3,17.14 25.4,15.24 CC.6
TXD3
  Bottom 0.305: SMIRF.4 34.29,10.16 34.29,7.62 CC.8